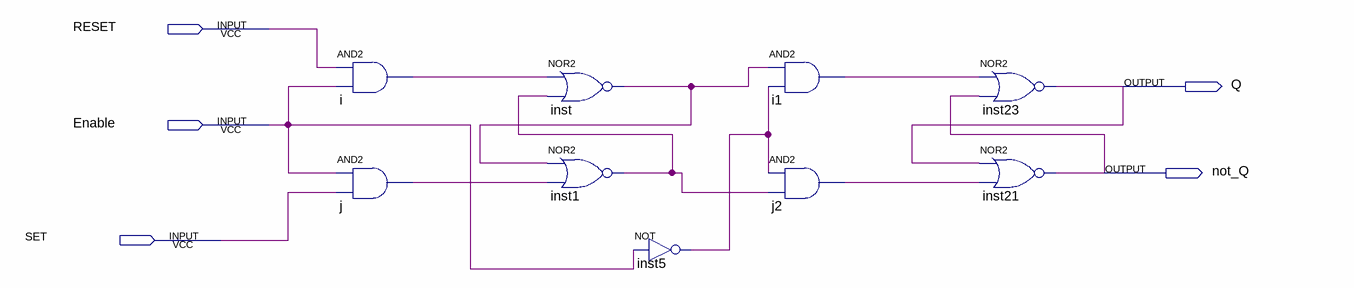
[diagram p0: schematic sheet]
// Quartus schematic Third_les.bdf as structural Verilog: 9 symbols, 5 pins
module Third_les (
  input  RESET,
  input  Enable,
  input  SET,
  output Q,
  output not_Q
);

  wire i1_out, i_out, inst1_out, inst5_out, inst_out, j2_out, j_out;

  and i (i_out, RESET, Enable);
  and j (j_out, Enable, SET);
  nor inst (inst_out, i_out, inst1_out);
  nor inst1 (inst1_out, inst_out, j_out);
  not inst5 (inst5_out, Enable);
  and i1 (i1_out, inst_out, inst5_out);
  and j2 (j2_out, inst5_out, inst1_out);
  nor inst23 (Q, i1_out, not_Q);
  nor inst21 (not_Q, Q, j2_out);
endmodule
